# Altium schematic sheet PWM Regenerator.SchDoc
size A4; SheetNumber: 5; SheetTotal: 7
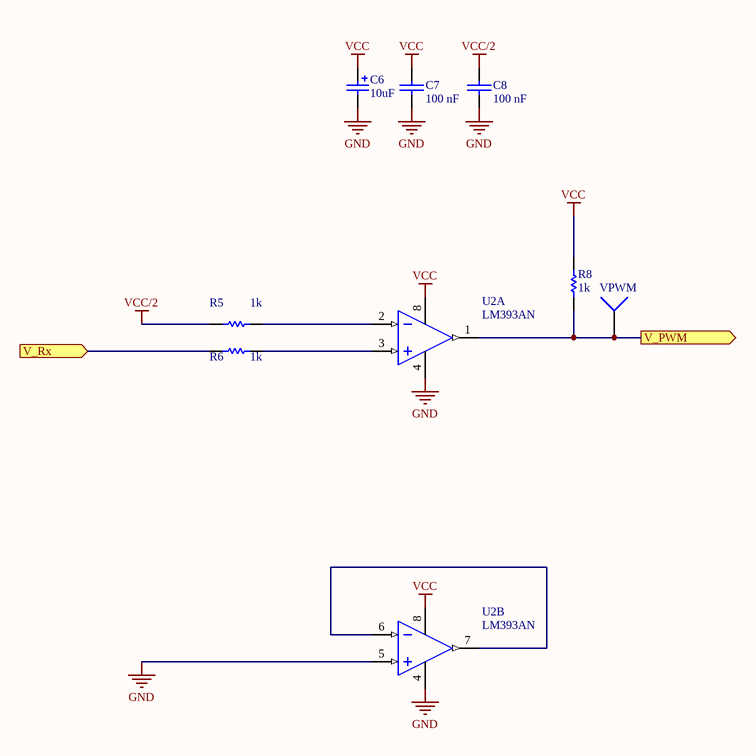
[diagram p0: PWM Regenerator.SchDoc]

## Parts
C6  10uF  [ece-CAPAD2TH0.3]
C7  100 nF  [ece-RAD0.2]
C8  100 nF  [ece-RAD0.2]
R5  1k  [ece-AXIAL0.4]
R6  1k  [ece-AXIAL0.4]
R8  1k  [ece-AXIAL0.4]
U2  LM393AN  [ECE-DIP8]  (parts A,B of 2)
VPWM  VPWM  [ece-HDR1]

## Ports
V_PWM (out), V_Rx (in)

## Nets
GND: C6.2 C7.2 C8.2 U2.4(GND) U2.5(IN+)
VCC: C6.1 C7.1 R8.2 U2.8(V+)
VCC/2: C8.1 R5.1
V_PWM: R8.1 U2.1(OUT) VPWM.1 ; port V_PWM
V_Rx: R6.1 ; port V_Rx
NetR5_2: R5.2 U2.2(IN-)
NetR6_2: R6.2 U2.3(IN+)
NetU2_6: U2.6(IN-) U2.7(OUT)

## Library data of the parts
C6 = CAP 22uF TH: Polarized Capacitor (Radial); Manufacturer: Generic Components; Class I: Passive; Published: 8-Jun-2000; Revision: July-2002: Re-released for DXP Platform.; Publisher: Altium Limited; Class II: Capacitor; Value: 10uF
C7 C8 = CAP: Capacitor Non Polarised Through Hole; Value: 100 nF
R5 R6 R8 = Res1: Resistor; Published: 8-Jun-2000; LatestRevisionDate: 17-Jul-2002; LatestRevisionNote: Re-released for DXP Platform.; PackageReference: AXIAL-0.3; Publisher: Altium Limited; Value: 1k
U2 = LM393AN: Dual Comparator; Published: 17-Jul-2002; LatestRevisionDate: 06-Jun-2005; LatestRevisionNote: Stylized 3D Model Added.; DatasheetVersion: 1988; PackageReference: 626-05; Publisher: Altium Limited; PackageDescription: DIP; 8 Leads; Row Spacing 7.62 mm; Pitch 2.54 mm; ComponentLink1Description: Manufacturer Link; ComponentLink1URL: http://www.onsemi.com/site/products/taxonomy/0,4438,133,00.html
VPWM = Test pin: Socket; LatestRevisionDate: 17-Jul-2002; LatestRevisionNote: Re-released for DXP Platform.; Publisher: Altium Limited